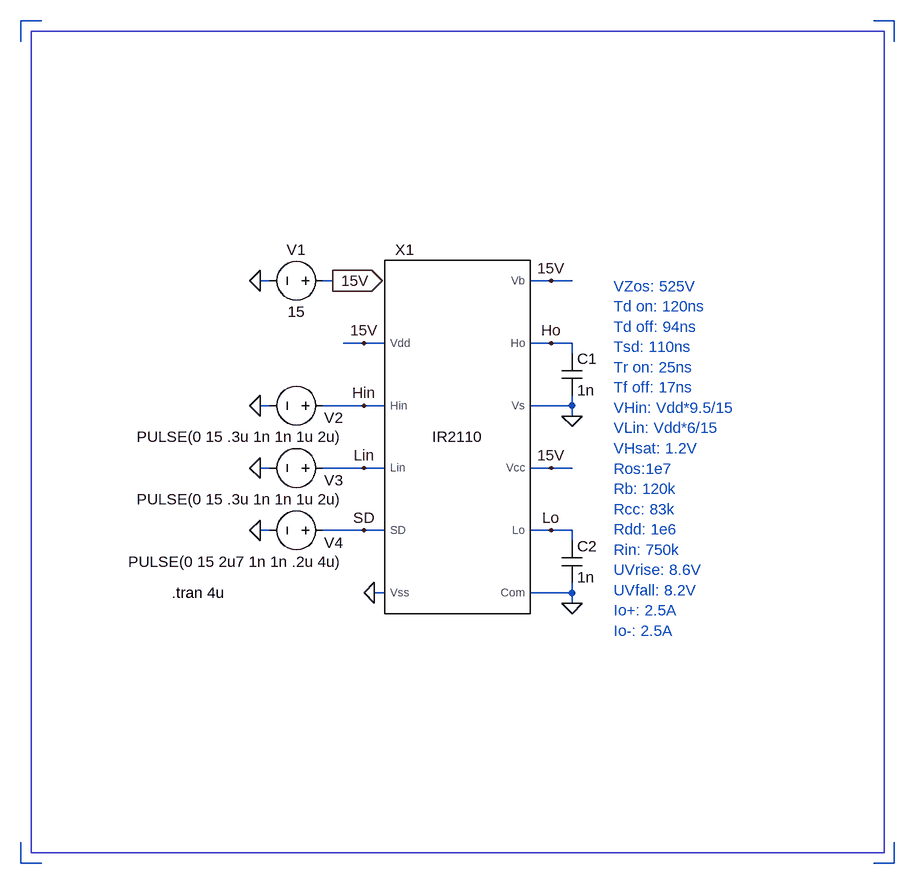
[diagram p0: schematic IR2110_test.asc]
IR2110_test.asc, the LTspice schematic file:
Version 4
SHEET 1 13828 1048
WIRE 736 -752 736 -784
WIRE 736 512 736 480
WIRE 768 -784 736 -784
WIRE 768 512 736 512
WIRE 1120 -384 1104 -384
WIRE 1120 -192 1104 -192
WIRE 1120 -96 1104 -96
WIRE 1120 0 1104 0
WIRE 1216 -384 1200 -384
WIRE 1264 -288 1232 -288
WIRE 1264 -192 1200 -192
WIRE 1264 -96 1200 -96
WIRE 1264 0 1200 0
WIRE 1296 -288 1264 -288
WIRE 1296 -192 1264 -192
WIRE 1296 -96 1264 -96
WIRE 1296 0 1264 0
WIRE 1296 96 1280 96
WIRE 1552 -384 1520 -384
WIRE 1552 -288 1520 -288
WIRE 1552 -96 1520 -96
WIRE 1552 0 1520 0
WIRE 1584 -384 1552 -384
WIRE 1584 -288 1552 -288
WIRE 1584 -272 1584 -288
WIRE 1584 -192 1520 -192
WIRE 1584 -192 1584 -208
WIRE 1584 -176 1584 -192
WIRE 1584 -96 1552 -96
WIRE 1584 0 1552 0
WIRE 1584 16 1584 0
WIRE 1584 96 1520 96
WIRE 1584 96 1584 80
WIRE 1584 112 1584 96
WIRE 2080 -784 2048 -784
WIRE 2080 -752 2080 -784
WIRE 2080 512 2048 512
WIRE 2080 512 2080 480
FLAG 1104 -96 0
FLAG 1264 -96 Lin
FLAG 1584 -176 0
FLAG 1552 -288 Ho
FLAG 1584 112 0
FLAG 1552 0 Lo
FLAG 1104 -192 0
FLAG 1264 -192 Hin
FLAG 1280 96 0
FLAG 1552 -384 15V
FLAG 1552 -96 15V
FLAG 1216 -384 15V
IOPIN 1216 -384 Out
FLAG 1104 -384 0
FLAG 1264 -288 15V
FLAG 1104 0 0
FLAG 1264 0 SD
SYMBOL voltage 1216 -192 R90
WINDOW 0 19 -16 VRight 0
WINDOW 3 48 -16 VRight 0
WINDOW 123 0 0 Left 0
WINDOW 39 0 0 Left 0
SYMATTR InstName V2
SYMATTR Value PULSE(0 15 .3u 1n 1n 1u 2u)
SYMBOL voltage 1216 -96 R90
WINDOW 0 19 -16 VRight 0
WINDOW 3 48 -16 VRight 0
WINDOW 123 0 0 Left 0
WINDOW 39 0 0 Left 0
SYMATTR InstName V3
SYMATTR Value PULSE(0 15 .3u 1n 1n 1u 2u)
SYMBOL cap 1568 -272 R0
SYMATTR InstName C1
SYMATTR Value 1n
SYMBOL cap 1568 16 R0
SYMATTR InstName C2
SYMATTR Value 1n
SYMBOL voltage 1216 -384 R90
WINDOW 0 -32 56 VBottom 0
WINDOW 3 32 56 VTop 0
SYMATTR InstName V1
SYMATTR Value 15
SYMBOL IR2110 1408 -144 R0
SYMATTR InstName X1
SYMBOL voltage 1216 0 R90
WINDOW 0 19 -16 VRight 0
WINDOW 3 48 -16 VRight 0
WINDOW 123 0 0 Left 0
WINDOW 39 0 0 Left 0
SYMATTR InstName V4
SYMATTR Value PULSE(0 15 2u7 1n 1n .2u 4u)
TEXT 1648 -376 Left 0 ;VZos: 525V\nTd on: 120ns\nTd off: 94ns\nTsd: 110ns\nTr on: 25ns\nTf off: 17ns\nVHin: Vdd*9.5/15\nVLin: Vdd*6/15\nVHsat: 1.2V\nRos:1e7\nRb: 120k\nRcc: 83k\nRdd: 1e6\nRin: 750k\nUVrise: 8.6V\nUVfall: 8.2V\nIo+: 2.5A\nIo-: 2.5A
TEXT 968 96 Left 0 !.tran 4u
RECTANGLE Normal 2064 496 752 -768

The netlist it stands for:
* IR2110_test.asc
V2 Hin 0 PULSE(0 15 .3u 1n 1n 1u 2u)
V3 Lin 0 PULSE(0 15 .3u 1n 1n 1u 2u)
C1 Ho 0 1n
C2 Lo 0 1n
V1 15V 0 15
XX1 15V Hin Lin SD 0 0 Lo 15V 0 Ho 15V IR2110 params: IR2110  ; pins Vdd Hin Lin SD Vss Com Lo Vcc Vs Ho Vb
V4 SD 0 PULSE(0 15 2u7 1n 1n .2u 4u)
* VZos: 525V
* Td on: 120ns
* Td off: 94ns
* Tsd: 110ns
* Tr on: 25ns
* Tf off: 17ns
* VHin: Vdd*9.5/15
* VLin: Vdd*6/15
* VHsat: 1.2V
* Ros:1e7
* Rb: 120k
* Rcc: 83k
* Rdd: 1e6
* Rin: 750k
* UVrise: 8.6V
* UVfall: 8.2V
* Io+: 2.5A
* Io-: 2.5A
.tran 4u
.backanno
.end